# EAGLE schematic EnviroTron32 (EAGLE 9.5.1)
AUTHOR: w. boyett; CONTACT_ADDRESS: github.com/watsonboyett; REV: 2A
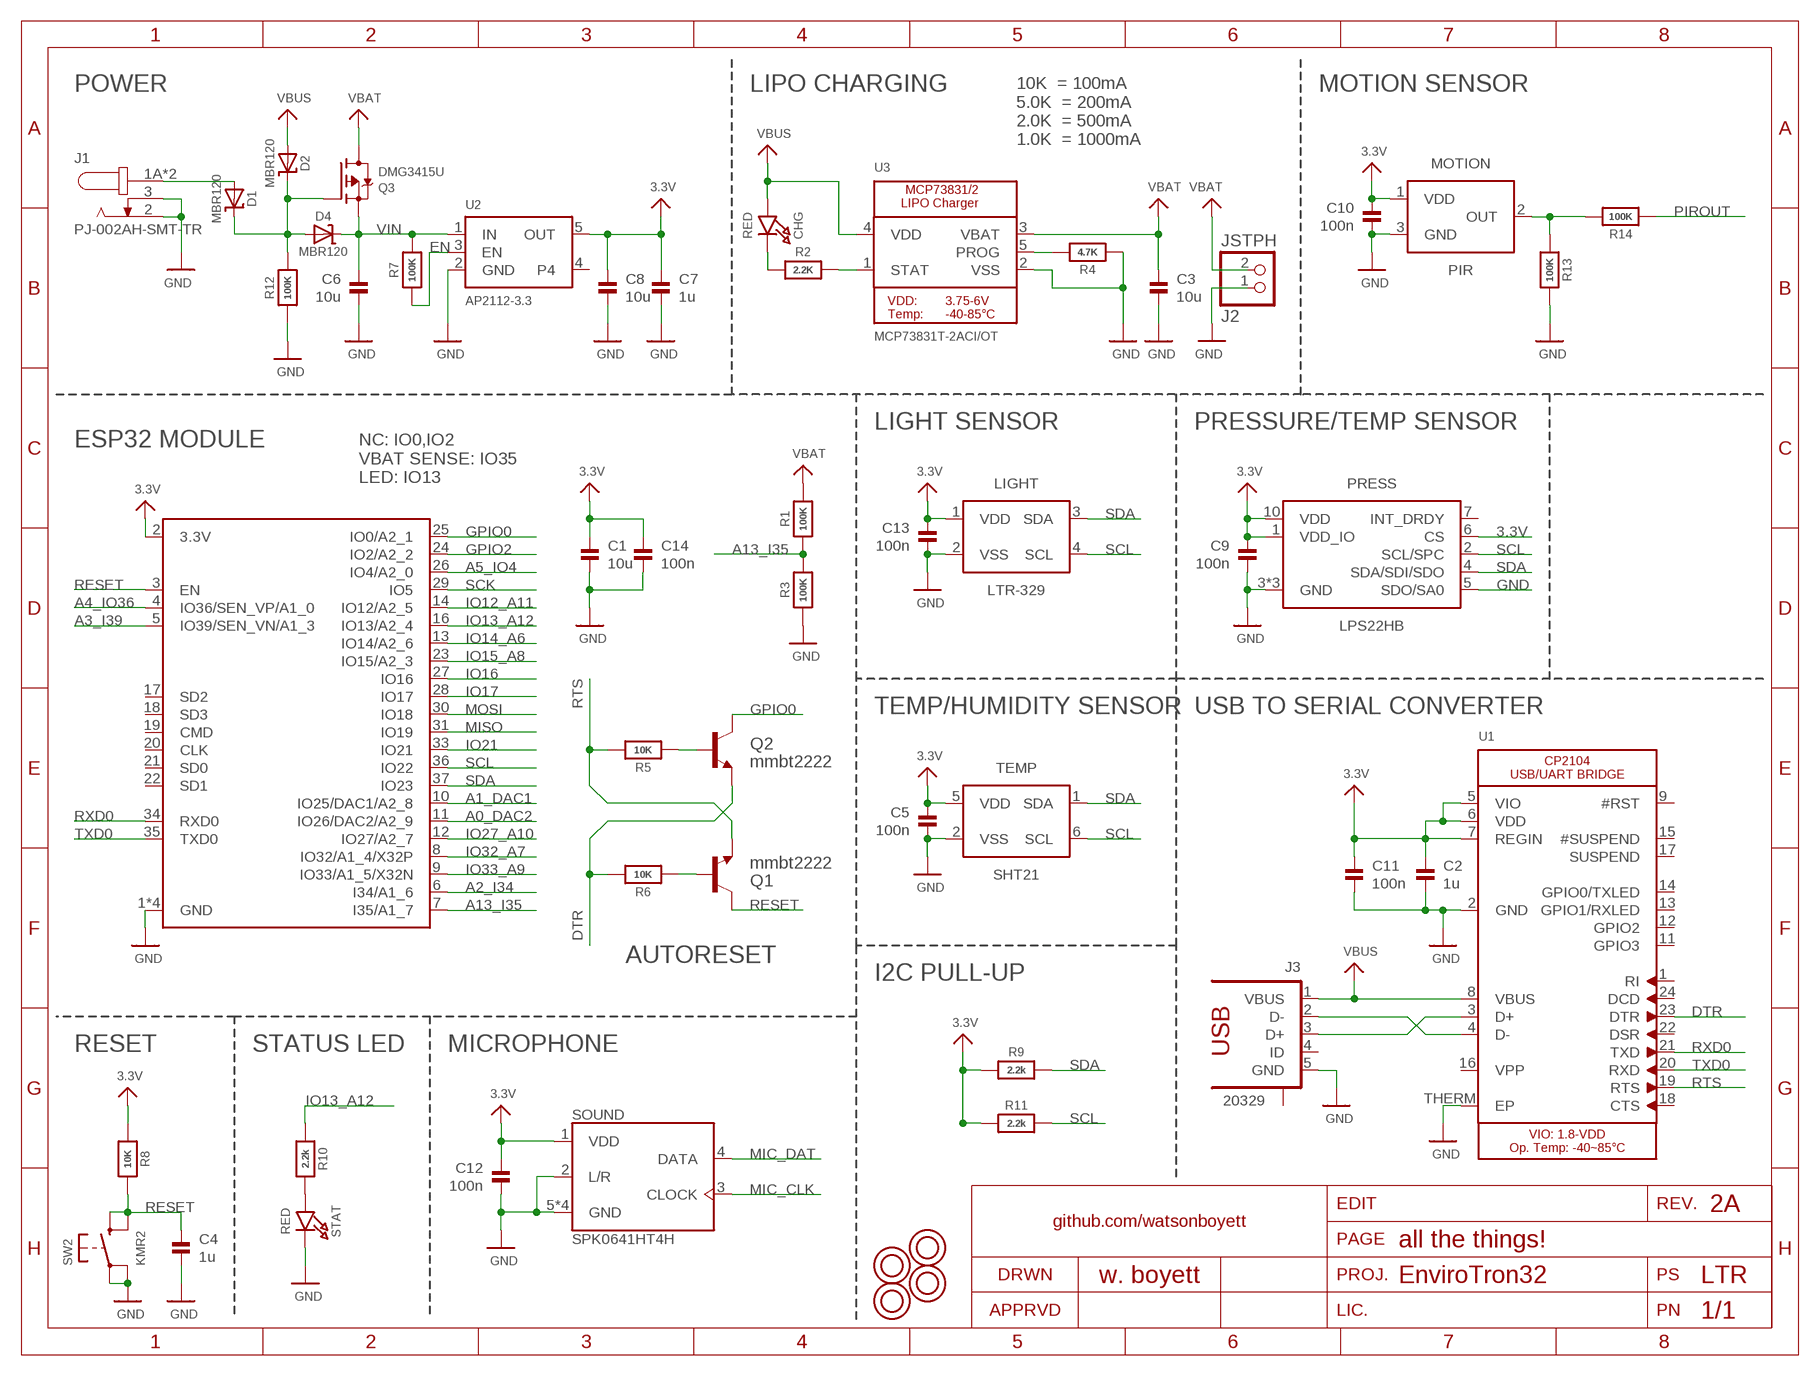
[diagram p0: schematic, sheet 1]
FRAME1 (LETTER_L): SECTION: all the things!

## Parts
C1  10u  CAP_CERAMIC0805-NOOUTLINE  [0805-NO]
C2  1u  CAP_CERAMIC_0603  [_0603]
C3  10u  CAP_CERAMIC0805-NOOUTLINE  [0805-NO]
C4  1u  CAP_CERAMIC0603_NO  [0603-NO]
C5  100n  CAP_CERAMIC_0603  [_0603]
C6  10u  CAP_CERAMIC0805-NOOUTLINE  [0805-NO]
C7  1u  CAP_CERAMIC0603_NO  [0603-NO]
C8  10u  CAP_CERAMIC0805-NOOUTLINE  [0805-NO]
C9  100n  CAP_CERAMIC_0603  [_0603]
C10  100n  CAP_CERAMIC_0603  [_0603]
C11  100n  CAP_CERAMIC_0603  [_0603]
C12  100n  CAP_CERAMIC_0603  [_0603]
C13  100n  CAP_CERAMIC_0603  [_0603]
C14  100n  CAP_CERAMIC_0603  [_0603]
CHG  RED  LED0805_NOOUTLINE  [CHIPLED_0805_NOOUTLINE]
D1  MBR120  DIODE-SCHOTTKYSOD-123  [SOD-123]
D2  MBR120  DIODE-SCHOTTKYSOD-123  [SOD-123]
D4  MBR120  DIODE-SCHOTTKYSOD-123  [SOD-123]
J1  PJ-002AH-SMT-TR  [CUI_PJ-002AH-SMT-TR]
J2  JSTPH  CON_JST_PH_2PIN  [JSTPH2]
J3  20329  USB-MICRO  [USB-10118192-0001LF]
LIGHT  LTR-329  [CHIPLED4]
MOTION  PIR  [CAN3]
PRESS  LPS22HB  [HLGA-10L]
Q1  mmbt2222  TRANSISTOR_NPNSOT23-3  [SOT23-3]
Q2  mmbt2222  TRANSISTOR_NPNSOT23-3  [SOT23-3]
Q3  DMG3415U  MOSFET-P  [SOT23-R]
R1  100K  RESISTOR_0603_NOOUT  [0603-NO]
R2  2.2K  RESISTOR_0603_NOOUT  [0603-NO]
R3  100K  RESISTOR_0603_NOOUT  [0603-NO]
R4  4.7K  RESISTOR_0603_NOOUT  [0603-NO]
R5  10K  RESISTOR_0603_NOOUT  [0603-NO]
R6  10K  RESISTOR_0603_NOOUT  [0603-NO]
R7  100K  RESISTOR_0603_NOOUT  [0603-NO]
R8  10K  RESISTOR_0603_NOOUT  [0603-NO]
R9  2.2k  RESISTOR_0603_NOOUT  [0603-NO]
R10  2.2k  RESISTOR_0603_NOOUT  [0603-NO]
R11  2.2k  RESISTOR_0603_NOOUT  [0603-NO]
R12  100K  RESISTOR_0603_NOOUT  [0603-NO]
R13  100K  RESISTOR_0603_NOOUT  [0603-NO]
R14  100K  RESISTOR_0603_NOOUT  [0603-NO]
SOUND  SPK0641HT4H  [SPK0641HT4H-1]
STAT  RED  LED0805_NOOUTLINE  [CHIPLED_0805_NOOUTLINE]
SW2  KMR2  SWITCH_TACT_SMT4.6X2.8  [BTN_KMR2_4.6X2.8]
TEMP  SHT21  [SHT2X-DFN6]
U1  CP2104  [QFN24_4MM_SMSC]
U2  AP2112-3.3  VREG_SOT23-5  [SOT23-5]
U3  MCP73831T-2ACI/OT  MCP73831/2  [SOT23-5]
U$17  TERM-7774  [TERM-7774]
U$31  TERM-7774  [TERM-7774]
U$32  TERM-7774  [TERM-7774]
U$34  TERM-7774  [TERM-7774]
X2  ESP32_WROOM32_SKINNY  [WROOM32_SKINNY]

## Nets
3.3V: C1.1 C2.1 C5.1 C7.1 C8.1 C9.1 C10.1 C11.1 C12.1 C13.1 C14.1 LIGHT.1(VDD) MOTION.1(VDD) PRESS.1(VDD_IO) PRESS.6(CS) PRESS.10(VDD) R8.1 R9.1 R11.1 SOUND.1(VDD) TEMP.5(VDD) U1.5(VIO) U1.6(VDD) U1.7(REGIN) U2.5(OUT) X2.2(3.3V)
A0_DAC2: X2.11(IO26/DAC2/A2_9)
A1_DAC1: X2.10(IO25/DAC1/A2_8)
A2_I34: X2.6(I34/A1_6)
A3_I39: X2.5(IO39/SEN_VN/A1_3)
A4_IO36: X2.4(IO36/SEN_VP/A1_0)
A5_IO4: X2.26(IO4/A2_0)
A13_I35: R1.1 R3.2 X2.7(I35/A1_7)
DCIN: D1.A J1.1A J1.1B
DTR: Q2.2(E) R6.2 U1.23(DTR)
EN: R7.1 U2.3(EN)
GND: C1.2 C2.2 C3.2 C4.2 C5.2 C6.2 C7.2 C8.2 C9.2 C10.2 C11.2 C12.2 C13.2 C14.2 J1.2 J1.3 J2.1 J3.5(GND) LIGHT.2(VSS) MOTION.3(GND) PRESS.3(GND) PRESS.5(SDO/SA0) PRESS.8(GND) PRESS.9(GND) R3.1 R4.1 R12.1 R13.2 SOUND.2(L/R) SOUND.5(GND) SOUND.6(GND) SOUND.7(GND) SOUND.8(GND) STAT.C SW2.A'(P1) SW2.A(P) TEMP.2(VSS) U1.2(GND) U1.THERM(EP) U2.2(GND) U3.2(VSS) X2.1(GND) X2.15(GND) X2.38(GND) X2.P$1(GND)
GPIO0: Q2.3(C) X2.25(IO0/A2_1)
GPIO2: X2.24(IO2/A2_2)
IO12_A11: X2.14(IO12/A2_5)
IO13_A12: R10.1 X2.16(IO13/A2_4)
IO14_A6: X2.13(IO14/A2_6)
IO15_A8: X2.23(IO15/A2_3)
IO16: X2.27(IO16)
IO17: X2.28(IO17)
IO21: X2.33(IO21)
IO27_A10: X2.12(IO27/A2_7)
IO32_A7: X2.8(IO32/A1_4/X32P)
IO33_A9: X2.9(IO33/A1_5/X32N)
MIC_CLK: SOUND.3(CLOCK)
MIC_DAT: SOUND.4(DATA)
MISO: X2.31(IO19)
MOSI: X2.30(IO18)
N$1: CHG.C R2.1
N$2: J3.3(D+) U1.3(D+)
N$3: R2.2 U3.1(STAT)
N$4: R4.2 U3.5(PROG)
N$5: R10.2 STAT.A
N$6: J3.2(D-) U1.4(D-)
N$7: D1.C D2.C D4.A Q3.1(G) R12.2
N$8: MOTION.2(OUT) R13.1 R14.2
N$12: Q1.1(B) R6.1
N$13: Q2.1(B) R5.1
PIROUT: R14.1
RESET: C4.1 Q1.3(C) R8.2 SW2.B'(S1) SW2.B(S) X2.3(EN)
RTS: Q1.2(E) R5.2 U1.19(RTS)
RXD0: U1.21(TXD) X2.34(RXD0)
SCK: X2.29(IO5)
SCL: LIGHT.4(SCL) PRESS.2(SCL/SPC) R11.2 TEMP.6(SCL) X2.36(IO22)
SDA: LIGHT.3(SDA) PRESS.4(SDA/SDI/SDO) R9.2 TEMP.1(SDA) X2.37(IO23)
TXD0: U1.20(RXD) X2.35(TXD0)
VBAT: C3.1 J2.2 Q3.3(D) R1.2 U3.3(VBAT)
VBUS: CHG.A D2.A J3.1(VBUS) U1.8(VBUS) U3.4(VDD)
VIN: C6.1 D4.C Q3.2(S) R7.2 U2.1(IN)
Unconnected: J3.4(ID) J3.M1(S) J3.M2(S) J3.S1(S) J3.S2(S) J3.S3(S) J3.S4(S) PRESS.7(INT_DRDY) U1.1(RI) U1.9(#RST) U1.11(GPIO3) U1.12(GPIO2) U1.13(GPIO1/RXLED) U1.14(GPIO0/TXLED) U1.15(#SUSPEND) U1.16(VPP) U1.17(SUSPEND) U1.18(CTS) U1.22(DSR) U1.24(DCD) U2.4 X2.17(SD2) X2.18(SD3) X2.19(CMD) X2.20(CLK) X2.21(SD0) X2.22(SD1)

## Notes on the sheet
- POWER | LIPO CHARGING | MOTION SENSOR
- 10K  = 100mA
  5.0K  = 200mA
  2.0K  = 500mA
  1.0K  = 1000mA
- LIGHT SENSOR | PRESSURE/TEMP SENSOR
- ESP32 MODULE
- NC: IO0,IO2
  VBAT SENSE: IO35
  LED: IO13
- TEMP/HUMIDITY SENSOR | USB TO SERIAL CONVERTER
- AUTORESET
- I2C PULL-UP
- RESET | STATUS LED | MICROPHONE

## Library data of the parts
C1-C14 = EnviroTron32:CAP_CERAMIC: Ceramic Capacitors For new designs, use the packages preceded by an '_' character since they are more reliable: The following footprints should be used on most boards: _0402 - Standard footprint for regular board layouts _0603 - Standard footprint for regular board layouts _0805 - Standard footprint for regular board layouts _1206 - Standard footprint for regular board layouts For extremely tight-pitch boards where space is at a premium, the following 'micro-pitch' footprints can be used (smaller pads, no silkscreen outline, etc.): _0402MP - Micro-pitch footprint for very dense/compact boards _0603MP - Micro-pitch footprint for very dense/compact boards _0805MP - Micro-pitch footprint for very dense/compact boards _1206MP - Micro-pitch footprint for very dense/compact boards
CHG STAT = EnviroTron32:LED: LED 0603 - 0603 Surface Mount Package 2mA: Green LED - Low Power (3.9mcd, 2ma, 1.7Vf) - Digikey: 475-2709-2-ND Orange LED - Low Power (9.8mcd, 2ma, 1.8Vf) - Digikey: 475-1194-2-ND Red LED - Low Power (5mcd, 2ma, 1.8Vf) - Digikey: 475-1195-2-ND Yellow LED - Low Power (7mcd, 2ma, 1.8Vf) - Digikey: 475-1196-2-ND 5mA: Blue LED - Low Power (17mcd, 5ma, 2.9Vf) - Digikey: LNJ937W8CRACT-ND 0805 - 0805 Surface Mount Package 2mA: Red LED (8.8mcd, 2mA, 1.8Vf, Clear) - Low Power [Digikey: 475-2510-1-ND] Green LED (5mcd, 2mA, 1.8Vf, Clear) - Low Power [Digikey: 475-2730-1-ND] Yellow LED (11.3mcd, 2mA, 1.8Vf, Clear) - Low Power [Digikey: 475-2555-1-ND] 20mA: Red LED (104mcd, 20mA, Diffused) - LS R976 [Digikey: 475-1278-6-ND] Red LED (12mcd, 20mA, 2.0Vf, Clear) - APT2012EC [Digikey: 754-1128-1-ND] Green LED (15mcd, 20mA, 2.2Vf, Clear) - APT2012GC [Digikey: 754-1131-1-ND] Orange LED (160mcd, 20mA, 2.1Vf, Clear) - APT2012SECK [Digikey: 754-1130-1-ND] 1206 - 1206 Surface Mount Package Green LED (26mcd, 20mA, Diffused) - LG N971 [Digikey: 475-1407-6-ND] Red LED (15mcd, 20mA, Diffused) - LH N974 [Digikey: 475-1416-6-ND] Cree - Cree High-Power Surface Mount LEDs XPEBWT-L1-0000-00D50 - White 111lm 350mA 2.9Vf 6200K 110° XTEAWT-00-0000-00000LEE3 - White 114lm 350mA 2.85Vf 5000K 115° Everlight - Everlight 45-21 Series Surface Mount LEDs 45-21/QK2C-B2832AC2CB2/2T - Warm White 2000mcd 20mA 3.25Vf 3050K 120° 45-21/LK2C-B38452C4CB2/2T - Nuetral White 2000mcd 20mA 3.25Vf 4150K 120° 45-21/LK2C-B50634C6CB2/2T - Cold White 2200mcd 20mA 3.25Vf 5650K 120° PLCC2 Reverse Mount LS T77K-J1L2-1-0-2-R18-Z - Red 11.25mcd 2mA 1.8Vf 630nm 120° LO T77K-L1M2-24-Z - Orange 19.6mcd 2mA 1.8Vf 606nm 120° LY T77K-K2M1-26-Z - Yellow 15.7mcd 2mA 1.8Vf 587nm 120°
D1 D2 D4 = EnviroTron32:DIODE-SCHOTTKY
J1 = EnviroTron32:PJ-002AH-SMT-TR: Power Barrel Connector Jack 2.00mm ID (0.079"), 5.50mm OD (0.217"); MFG: CUI; MPN: PJ-002AH-SMT-TR; PN-DK: CP-002AHPJCT-ND
J2 = EnviroTron32:CON_JST_PH_2PIN: JST 2-Pin Right-Angle Connector PH-Series - 4UConnector: 17311 SH-Series - 4UConnector: 07278
J3 = EnviroTron32:USB-MICRO: CONN USB MICRO B RECPT SMT R/A; MFG: Amphenol; MPN: 10118192-0001LF; PN-DK: 609-4613-1-ND
LIGHT = EnviroTron:LTR-329: AMBIENT LIGHT PHOTO SENSOR Optical Sensor Ambient I²C; MFG: Lite-On Inc.; MPN: LTR-329ALS-01; PN-DK: 160-2160-1-ND
MOTION = EnviroTron:PIR: Sensor Motion, Pyroelectric, PIR (Passive Infrared) 197" (5m) 16.4' Polyethylene, Black Lens; MFG: Panasonic Electric Works; MPN: EKMC1601112; PN-DK: 255-3075-ND
PRESS = EnviroTron:LPS22HB: Pressure Sensor 3.77 PSI ~ 18.27 PSI (26 kPa ~ 126 kPa) Absolute 24 bit; MFG: STMicroelectronics; MPN: LPS22HBTR; PN-DK: 497-16265-1-ND
Q1 Q2 = EnviroTron32:TRANSISTOR_NPN: Transistor NPN BJT configuration in SOT23 package. MMBT2222 is the common NPN we use. Double check BCE configuration again layout.
Q3 = EnviroTron32:MOSFET-P: P-Channel Mosfet LEGEND VDS: Voltage Drain-Source ID: Drain Current RDS(ON): Drain-Source On-State Resistance VGS(TH): Gate-Source Threshold Voltage CISS: Drain-Source Input Capacitance SOT-23 Name VDS ID RDS(ON) VGS(TH) CISS Order Number IRLML5103 30V 760mA 600 mOhm -- 75pF @ 25V Digikey: IRLML5103PBFCT-ND IRLML6401 12V 4.3A 50 mOhm 950mV @ 250µA 830pF @ 10V Digikey: IRLML6401PBFTR-ND NTR0202PL 20V 400mA 800 mOhm 2.3V @ 250uA 70pF @ 5V Digikey: NTR0202PLT1GOSTR-ND NTR4101PT1G 20V 1.8A 85 mOhm 1.2V @ 250uA 675pF @ 10V Digikey: NTR4101PT1GOSCT-ND DMP2004K 20V 600mA 900 mOhm 1V @ 250uA 175pF @ 16V Digikey: DMP2004KDICT-ND PMV65XP 20V 3.9A 76 mOhm 950mV @ 1mA 725pF @ 20V Digikey: 568-2358-2-ND TO-252 Name VDS ID RDS(ON) VGS(TH) CISS Order Number AOD417 30V 25A 34 mOhm 3V @ 250µA 920pF @ 15V Digikey: 785-1106-2-ND PowerPak Name VDS ID RDS(ON) VGS(TH) CISS Order Number AON7401 30V 12A 14 mOhm 3V @ 250µA 2600pF @ 15V Digikey: 785-1302-1-ND
R1-R14 = EnviroTron32:RESISTOR: Resistors For new designs, use the packages preceded by an '_' character since they are more reliable: The following footprints should be used on most boards: _0402 - Standard footprint for regular board layouts _0603 - Standard footprint for regular board layouts _0805 - Standard footprint for regular board layouts _1206 - Standard footprint for regular board layouts For extremely tight-pitch boards where space is at a premium, the following 'micro-pitch' footprints can be used (smaller pads, no silkscreen outline, etc.): _0402MP - Micro-pitch footprint for very dense/compact boards _0603MP - Micro-pitch footprint for very dense/compact boards _0805MP - Micro-pitch footprint for very dense/compact boards _1206MP - Micro-pitch footprint for very dense/compact boards
SOUND = EnviroTron:SPK0641HT4H; AVAILABILITY: Unavailable; CUI_PURCHASE_URL: https://www.cui.com/product/audio/microphones/mems-microphones/cmm-4030dt-26354-tr?utm_source=snapeda.com&utm_medium=referral&utm_campaign=snapedaBOM; DESCRIPTION: 4.0 x 3.0 mm, Digital, Top Port, Surface Mount, 2.0 Vdc, -26 ±3 dB, MEMS Microphone; MF: CUI Inc.; MP: CMM-4030DT-26354-TR; PACKAGE: CUI Inc.; PRICE: None
SW2 = EnviroTron32:SWITCH_TACT_SMT: SMT Tact Switches 6x6mm - Digikey: P12940SCT-ND KMR2 (4.6x2.8mm) - Digikey: 401-1426-1-ND EVQ-PQHB55 - Light Touch, 160GF (4.5x4.5mm) - Digikey: P8090SCT-ND KMT0 - KMT021 NGJ LHS (etc.) IP68/Waterproof - Digikey: CKN10289CT-ND
TEMP = EnviroTron:SHT21: SENSOR Humidity/Temperature 3V I2C 2%; MFG: Sensirion AG; MPN: SHT21; PN-DK: 1649-1005-1-ND
U1 = EnviroTron32:CP2104: CP2104 - USB to UART Bridge VDD Output: 3.45V
U2 = EnviroTron32:VREG_SOT23-5: SOT23-5 Fixed Voltage Regulators Part Current Out V Out V In V Dropout θJA (°C/W) TJ (°C) Digikey Part No. ADP121 150mA 3.3V 3.4-5.5V 0.09V @ 150mA -- -- ADP121-AUJZ33R7CT-ND ADP121 150mA 3.0V 3.1-5.5V 0.09V @ 150mA -- -- ADP121-AUJZ30R7CT-ND ADP122 300mA 3.3V 3.4-5.5V 0.085V @ 300mA -- -- ADP122AUJZ-3.3-R7CT-ND ADP1712 300mA 3.3V 3.5-5.5V 0.17V @ 300mA -- -- ADP1712AUJZ-3.3-R7TR-ND AP7311 (Low Cost) 150mA 3.3V 3.5-6V 0.15V @ 150mA -- -- AP7311-33WG-7DICT-ND LD39015M18R 150mA 1.8V 1.9V-5.5V 0.08V @ 100mA -- -- 497-6977-1-ND LP2985A-33DBVR 150mA 3.3V 3.3-16V 0.28V @ 150mA 206 150 296-18479-1-ND MCP1824T-3302E/OT 300mA 3.3V 3.5V-6V 0.2V @ 300mA -- -- MCP1824T-3302E/OTCT-ND MIC5205-2.5YM5 TR 150mA 2.5V 2.7-16V 0.165V @ 150mA -- -- 576-1257-2-ND MIC5205-3.0YM5 TR 150mA 3.0V 3.2V-16V 0.165V @ 150mA -- -- 576-1258-2-ND MIC5205-3.3YM5 TR 150mA 3.3V 3.5V-16V 0.165V @ 150mA -- -- 576-1259-2-ND TPS780330220 150mA 3.3V+2.2V 3.6-5.5V 250mV Max -- -- 296-23332-1-ND TDA3663/N1,135 100mA 3.3V 3.5-45V 0.18V @ 50mA -- -- 568-5343-1-ND Max operating temp can be calculated using θJA, TJ (max junction temperature), and power in watts. Set the "Maximum Ambient Temperature" until it reaches TJ ("Max Junction Temperature"), which is the absolute limit for safe use of the regulator: Heat Sink Temperature Calculator <http://www.daycounter.com/Calculators/Heat-Sink-Temperature-Calculator.phtml> For example, With 12V source into a 3.3V LP2985 and a 30mA load, we are dissipating (12V-3.3V) * 0.03A = 0.261W. With a θJA of 206 °C/W, a TJ of 150°C, and 261mW we can safely use the chip without a heat sink up to 75°C (=147.1°C Junction Temperature).
U3 = EnviroTron32:MCP73831/2: MCP73831/2 LIPO Charger VDD: 3.75 - 6V Temp -40 - 85°C Programmable Charge Rate: 15-500mA NOTE: STAT is a tri-state logic output on the MCP73831 and an open-drain output on the MCP73832. SOT23-5 with 4.2V output and tri-state logic on STAT = MCP73831T-2ACI/OT
U$17 U$31 U$32 U$34 = EnviroTron32:TERM: TERM SCREW 4-40 4 PIN PCB RA; MFG: Keystone Electronics; MPN: 7774; PN-DK: 36-7774-ND
X2 = EnviroTron32:ESP32_WROOM32